# Altium schematic sheet USB-ESP32.SchDoc
size B
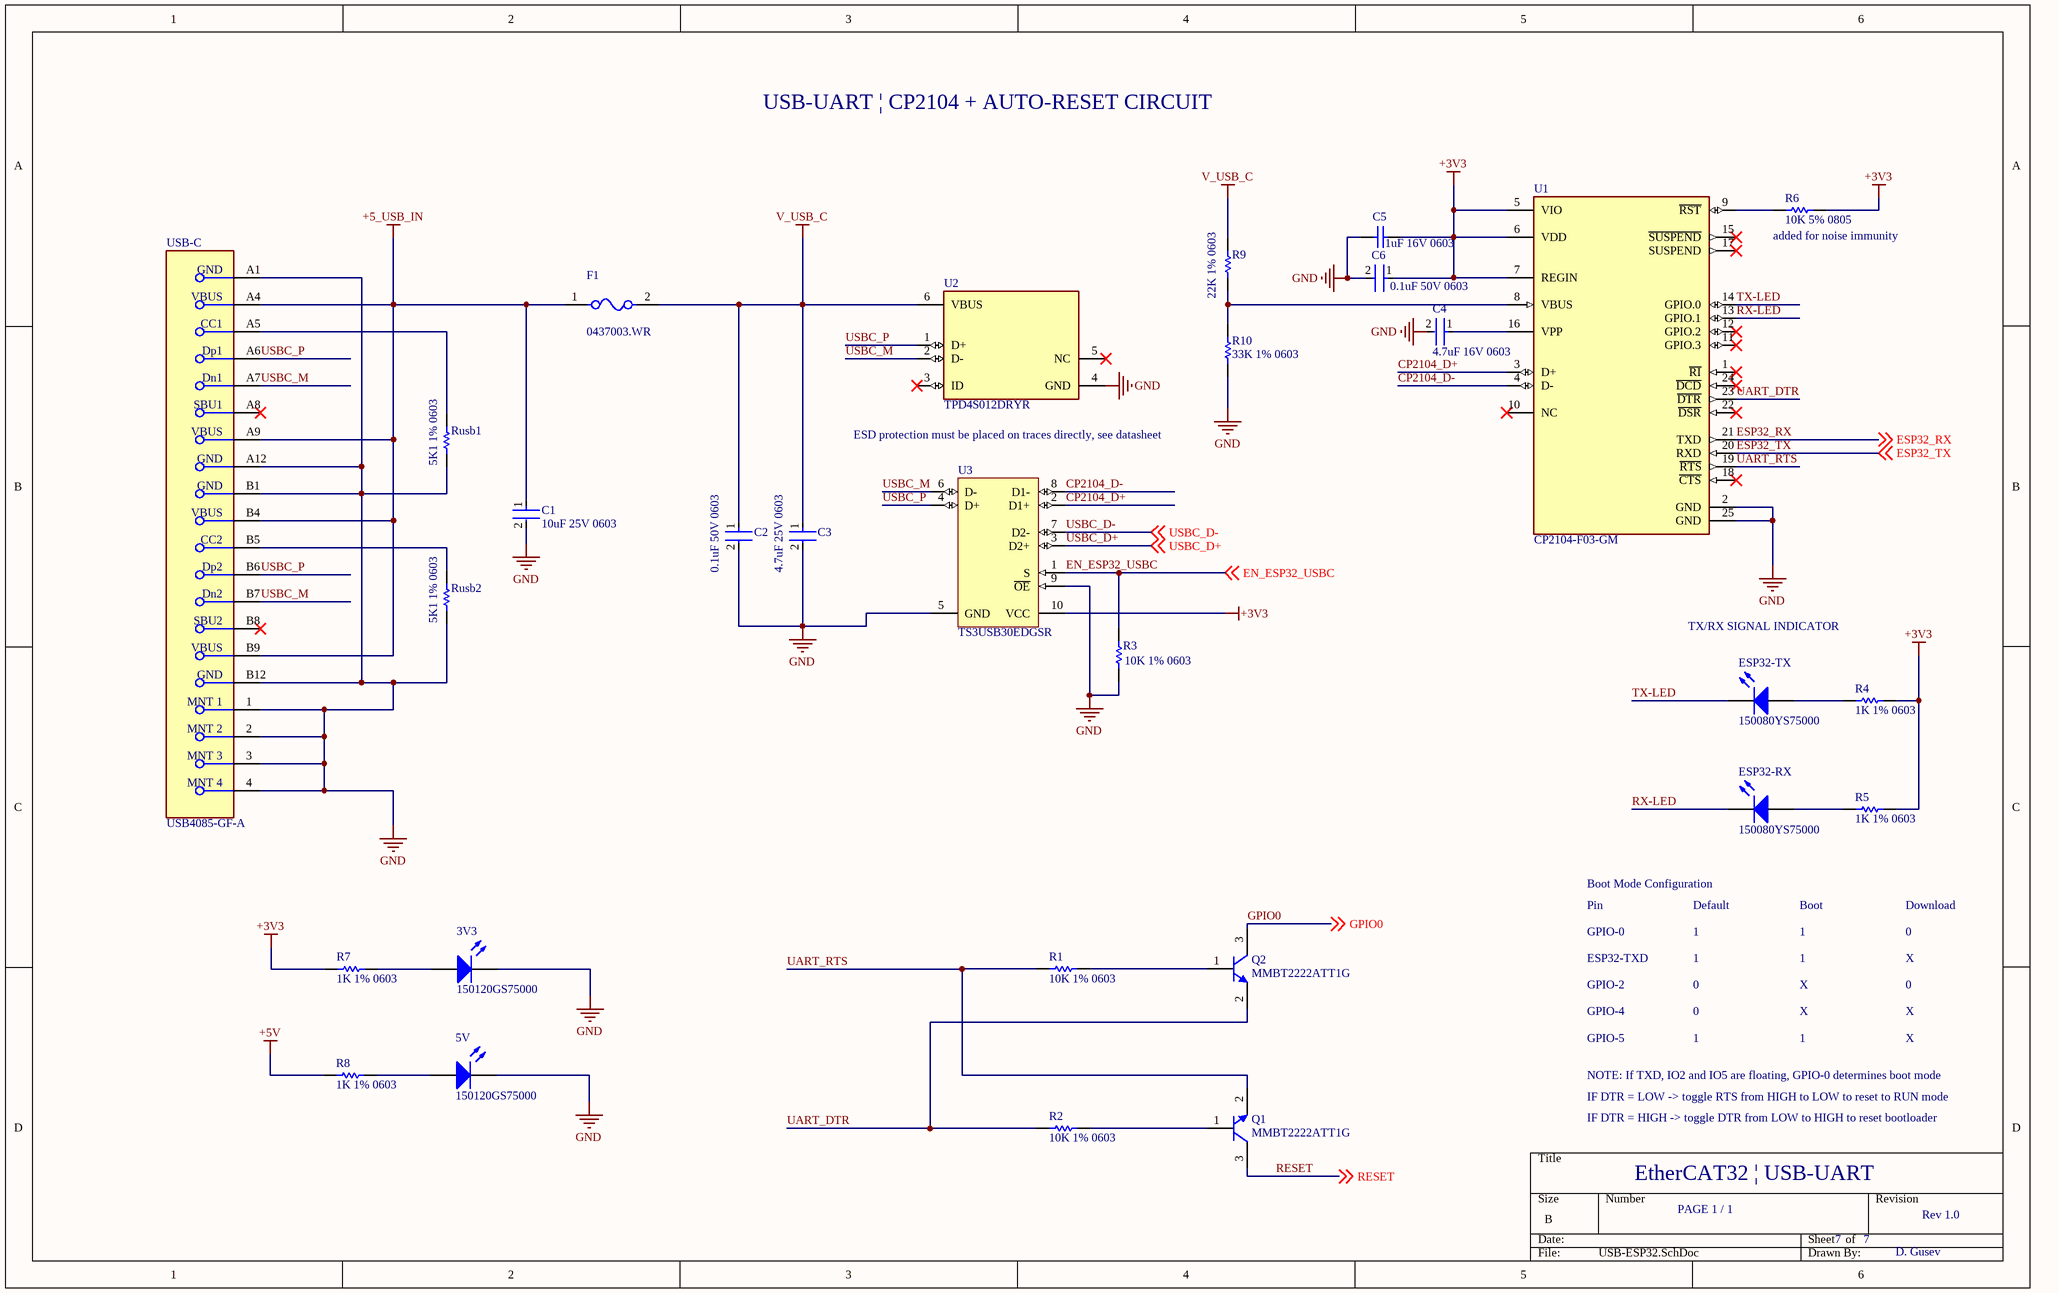
[diagram p0: USB-ESP32.SchDoc]

## Parts
3V3  150120GS75000  [1206_A]
5V  150120GS75000  [1206_A]
C1  10uF 25V 0603  [FP-C1608-080-IPC_A]
C2  0.1uF 50V 0603  [FP-C0603C-CF-MFG]
C3  4.7uF 25V 0603  [FP-C1608X5R1E475M080AC-MFG]
C4  4.7uF 16V 0603  [FP-GRM188-0_15-IPC_B]
C5  1uF 16V 0603  [CAPC1608X90X35LL15T15]
C6  0.1uF 50V 0603  [FP-C0603C-CF-MFG]
ESP32-RX  150080YS75000  [0805_A]
ESP32-TX  150080YS75000  [0805_A]
F1  0437003.WR  [FP-437-MFG]
Q1  MMBT2222ATT1G  [ONSC-SC-75-3-463-01_V]
Q2  MMBT2222ATT1G  [ONSC-SC-75-3-463-01_V]
R1  10K 1% 0603  [RESC2013X70X40ML20T20]
R2  10K 1% 0603  [RESC2013X70X40ML20T20]
R3  10K 1% 0603  [RESC2013X70X40ML20T20]
R4  1K 1% 0603  [RESC1608X55X25ML10T15]
R5  1K 1% 0603  [RESC1608X55X25ML10T15]
R6  10K 5% 0805  [RESC2013X60X40ML20T25]
R7  1K 1% 0603  [RESC1608X55X25ML10T15]
R8  1K 1% 0603  [RESC1608X55X25ML10T15]
R9  22K 1% 0603  [RESC1608X55X30NL15T15]
R10  33K 1% 0603  [RESC1608X55X25LL10T15]
Rusb1  5K1 1% 0603  [RESC1608X55X25ML10T15]
Rusb2  5K1 1% 0603  [RESC1608X55X25ML10T15]
U1  CP2104-F03-GM  [FP-CP2104-F03-GM-MFG]
U2  TPD4S012DRYR  [FP-DRY0006A-MFG]
U3  TS3USB30EDGSR  [DGS0010A_N]
USB-C  USB4085-GF-A  [FP-USB4085-GF-A-MFG]

## Nets
+3V3: C5.2 C6.1 R4.2 R5.2 R6.1 R7.1 U1.5(VIO) U1.6(VDD) U1.7(REGIN) U3.10(VCC)
+5_USB_IN: C1.1 F1.1 USB-C.A4(VBUS) USB-C.A9(VBUS) USB-C.B4(VBUS) USB-C.B9(VBUS)
+5V: R8.1
GND: 3V3.1(K) 5V.1(K) C1.2 C2.2 C3.2 C4.2 C5.1 C6.2 R3.1 R10.1 Rusb1.1 Rusb2.1 U1.2(GND) U1.25(GND) U2.4(GND) U3.5(GND) U3.9(~{OE}) USB-C.1(MNT_1) USB-C.2(MNT_2) USB-C.3(MNT_3) USB-C.4(MNT_4) USB-C.A1(GND) USB-C.A12(GND) USB-C.B1(GND) USB-C.B12(GND)
V_USB_C: C2.1 C3.1 F1.2 R9.2 U2.6(VBUS)
CP2104_D+: U1.3(D+) U3.2(D1+)
CP2104_D-: U1.4(D-) U3.8(D1-)
EN_ESP32_USBC: R3.2 U3.1(S) ; off-sheet EN_ESP32_USBC
ESP32_RX: U1.21(TXD) ; off-sheet ESP32_RX
ESP32_TX: U1.20(RXD) ; off-sheet ESP32_TX
GPIO0: Q2.3(C) ; off-sheet GPIO0
RESET: Q1.3(C) ; off-sheet RESET
RX-LED: ESP32-RX.1(K) U1.13(GPIO.1)
TX-LED: ESP32-TX.1(K) U1.14(GPIO.0)
UART_DTR: Q2.2(E) R2.2 U1.23(~{DTR})
UART_RTS: Q1.2(E) R1.2 U1.19(~{RTS})
USBC_D+: U3.3(D2+) ; off-sheet USBC_D+
USBC_D-: U3.7(D2-) ; off-sheet USBC_D-
USBC_M: U2.2(D-) U3.6(D-) USB-C.A7(Dn1) USB-C.B7(Dn2)
USBC_P: U2.1(D+) U3.4(D+) USB-C.A6(Dp1) USB-C.B6(Dp2)
Net3V3_2: 3V3.2(A) R7.2
Net5V_2: 5V.2(A) R8.2
NetC4_1: C4.1 U1.16(VPP)
NetESP32-RX_2: ESP32-RX.2(A) R5.1
NetESP32-TX_2: ESP32-TX.2(A) R4.1
NetQ1_1: Q1.1(B) R2.1
NetQ2_1: Q2.1(B) R1.1
NetR6_2: R6.2 U1.9(~{RST})
NetR9_1: R9.1 R10.2 U1.8(VBUS)
NetRusb1_2: Rusb1.2 USB-C.A5(CC1)
NetRusb2_2: Rusb2.2 USB-C.B5(CC2)

Not connected (* = marked no-connect by the designer): U1 1(~{RI})* 10(NC)* 11(GPIO.3)* 12(GPIO.2)* 15(~{SUSPEND})* 17(SUSPEND)* 18(~{CTS})* 22(~{DSR})* 24(~{DCD})*; U2 3(ID)* 5(NC)*; USB-C A8(SBU1)* B8(SBU2)*

## Notes on the sheet
- USB-UART | CP2104 + AUTO-RESET CIRCUIT
- (near R6) added for noise immunity
- ESD protection must be placed on traces directly, see datasheet
- TX/RX SIGNAL INDICATOR
- Boot Mode Configuration
- Pin
- Default
- Boot
- Download
- GPIO-0
- ESP32-TXD
- 1
- 0
- X
- GPIO-2
- GPIO-4
- GPIO-5
- NOTE: If TXD, IO2 and IO5 are floating, GPIO-0 determines boot mode
- IF DTR = LOW -> toggle RTS from HIGH to LOW to reset to RUN mode
- IF DTR = HIGH -> toggle DTR from LOW to HIGH to reset bootloader
- EtherCAT32 | USB-UART
- PAGE 1 / 1
- 7
- Rev 1.0
- D. Gusev

## Library data of the parts
3V3 5V = CMP-1426-00014-1: SMD mono-color Chip LED, WL-SMCW, Green; Manufacturer: Wuerth Elektronik; PackageReference: 1206_A; PartNumber: 150120GS75000; ComponentLink1Description: Manufacturer URL; ComponentLink2URL: http://katalog.we-online.com/led/datasheet/150120GS75000.pdf; ComponentLink2Description: Datasheet; Color: Green; ComponentLink1URL: http://www.we-online.com
C1 = CMP-2000-05442-2: CAP CER 10UF 25V X5R 0603; Dielectric Material: Ceramic; Tolerance: 20%; Dielectric: X5R; Length: 1.6mm; Termination: SMD/SMT; Depth: 0.8mm; RoHS Compliant: Yes; Construction: Flat; Weight: 7.1E-05oz; Thickness: 0.039inch; Packaging: Tape and Reel; Min Operating Temperature: -55°C; Case Code (Imperial): 0603; Case/Package: 0603; Height: 0.8mm; Case Code (Metric): 1608; Voltage Rating: 25V; Resistor Type: Ceramic; Voltage Rating (DC): 25V; Max Operating Temperature: 85°C; REACH SVHC: No SVHC; Lead Free: Lead Free; Series: C; Width: 0.8mm; Mount: Surface Mount; Package Quantity: 1; Capacitance: 10uF
C2 C6 = CMP-2006-03061-2: CAP CER 0.1UF 50V X7R 0603; Manufacturer: KEMET; Manufacturer Part Number: C0603C104K5RACTU; Tolerance: 0.1; Description: C0603 0.10 μF X7R 30ppm/°C 10.00% 50 V; Temperature Coefficient: 30ppm/°C; Material: Ceramic; Automotive Grade: Grade 1; Value: 0.10 μF; Temperature: -55°C to +125°C; RoHS: TRUE; Temperature Range High: +125°C; Lead Free: Yes; Octopart: https://octopart.com/c0603c104k5ractu-kemet-139244; Digikey Description: CAP CER 0.1UF 50V X7R 0603; Category: Cap; Package: C0603C-CF; ComponentLink2Description: Datasheet; Temperature Range Low: -55°C; Device Class L1: Passive Components; Voltage Rating: 50 V; Automotive: Yes; Device Class L3: Ceramic Capacitors; ComponentLink2URL: https://api.kemet.com/component-edge/download/datasheet/C0603C100J5GACAUTO.pdf; Capacitance: 0.10 μF; Device Class L2: Capacitors; Temperature Characteristic: X7R; Height: 0.87mm
C3 = CMP-08246-004335-1: Multilayer Ceramic Capacitors 4.7μF ±20% 25V X5R SMD 0603; Capacitance: 4.7uF; Voltage Rating (DC): 25V; Width: 0.031inch; Resistor Type: Ceramic; Radiation Hardening: No; Lead Free: Lead Free; Min Operating Temperature: -55°C; Case Code (Metric): 1608; Case/Package: 0603; Case Code (Imperial): 0603; Dielectric Material: Ceramic; Series: C; Thickness: 0.039inch; Tolerance: 20%; Termination: SMD/SMT; Length: 1.6mm; Depth: 0.8mm; Mount: Surface Mount; Voltage Rating: 25V; Weight: 7.1E-05oz; RoHS Compliant: Yes; Height: 0.8mm; Dielectric: X5R; REACH SVHC: No SVHC; Packaging: Tape and Reel; Max Operating Temperature: 85°C; Package Quantity: 1
C4 = CMP-06035-062935-1: CAP CER 4.7UF 16V X5R 0603; Tolerance: 10%; Material: Ceramic; Thickness: 0.037inch; RoHS Compliant: Yes; REACH SVHC: No SVHC; Case Code (Metric): 1608; Width: 0.8mm; Lead Free: Lead Free; Packaging: Tape and Reel; Capacitance: 4.7uF; Depth: 0.8mm; Package Quantity: 4000; Mount: Surface Mount; Voltage Rating: 16V; Termination: SMD/SMT; Height: 0.8mm; Voltage Rating (DC): 16V; Weight: 0.000222oz; Dielectric: X5R; Case Code (Imperial): 0603; Series: GRM; Min Operating Temperature: -55°C; Max Operating Temperature: 85°C; Case/Package: 0603; Length: 1.6mm
C5 = CMP-2006-02298-2: Manufacturer: Kemet; Part Number: C0603C105K4RACTU
ESP32-RX ESP32-TX = CMP-1426-00012-1: SMD mono-color Chip LED, WL-SMCW, Yellow; Manufacturer: Wuerth Elektronik; Color: Yellow; ComponentLink1URL: http://www.we-online.com; PackageReference: 0805_A; ComponentLink2URL: http://katalog.we-online.com/led/datasheet/150080YS75000.pdf; ComponentLink1Description: Manufacturer URL; ComponentLink2Description: Datasheet; PartNumber: 150080YS75000
F1 = CMP-08605-000049-1: FUSE BRD MNT 3A 32VAC 35VDC 1206; Manufacturer: Littelfuse Inc; Fuse Interrupt Ac Current: 50A; Value: 0.033Ω; Fuse Blow Speed: Fast; Voltage Rating: 32V; Max Fuse Dc Voltage: 35V; Fuse I2T: 0.506A2Sec; Fuse Voltage Drop: 0.14V; Octopart: https://octopart.com/0437003.wr-littelfuse-8600121; Category: Fuse; Fuse Interrupt Dc Current: 50A; Temperature: -55°C to +150°C; Device Class L1: Circuit Protection; Fuse Current: 3A; Temperature Range High: +150°C; Temperature Range Low: -55°C; Resistance: 0.033Ω; Automotive: No; ComponentLink2URL: https://www.littelfuse.com/~/media/electronics/datasheets/fuses/littelfuse_fuse_437_datasheet.pdf.pdf; Manufacturer Part Number: 0437003.WR; Ipc Land Pattern Name: CAPC320163X82; Mouser Description: Surface Mount Fuses 32V FA 1206 3A; Device Class L2: Fuses; Device Class L3: unset; Package: 437; RoHS: TRUE; Height: 0.8639mm; Digikey Description: FUSE BRD MNT 3A 32VAC 35VDC 1206; ComponentLink2Description: Datasheet; Lead Free: Yes; Max Fuse Ac Voltage: 32V
Q1 Q2 = CMP-1048-00417-1: General Purpose Transistor, NPN Silicon, 3-Pin SC-75, Pb-Free, Tape and Reel; Manufacturer: On Semiconductor; IC Continuous (A): 0.6; fT Min (MHz): 300; DatasheetVersion: Rev. 5; PackageVersion: Rev. F, 07/2005; ComponentLink1Description: Manufacturer URL; RoHS: TRUE; Packing: Tape and Reel; ComponentLink3URL: http://www.onsemi.com/pub_link/Collateral/463-01.PDF; ComponentLink1URL: http://www.onsemi.com/; ComponentLink3Description: Package Specification; ComponentLink2URL: http://www.onsemi.cn/pub_link/Collateral/MMBT2222ATT1-D.PDF; Mounting Technology: Surface Mount; PartNumber: MMBT2222ATT1G; ComponentLink2Description: Datasheet; Polarity: NPN; PackageReference: SC-75-3-463-01; PackageDescription: 3-Pin Small Outline Transistor, Body 1.6 x 0.8 mm, Pitch 0.5 mm
R1-R3 = CMP-2001-04376-1: Manufacturer: Panasonic; Part Number: ERJ-6ENF1002V
R4 R5 R7 R8 = CMP-2000-05023-1: Chip Resistor, 1 KOhm, +/- 5%, 0.063 W, -55 to 155 degC, 0603 (1608 Metric), RoHS, Tape and Reel; Manufacturer: Yageo; Resistor Case Style: 0603[1608Metric]; Resistor Element Type: ThickFilm; Product Range: RCSeries; Resistance: 1kohm; SVHC: ToBeAdvised; Voltage Rating: 50V; Temperature Coefficient: ±100ppm/degC; Power Rating: 100mW; Packaging: CutTape; Manufacturer URL: http://www.yageo.com/; Resistance Tolerance: ±5%; Datasheet Version: Rev. 4, 04/2009; MSL: MSL1-Unlimited; Package Description: 2-Pin Surface Mount Device, Body 1.6 x 0.8 mm; Automotive Qualification Standard: -; Package Reference: 603; Datasheet URL: https://datasheet.ciiva.com/2452/pyu-rc0603-51-rohs-l-4-2452848.pdf
R6 = CMP-2001-00590-1: Part Number: ERA6AEB123V; Manufacturer: Panasonic
R9 = CMP-2000-00337-2: Chip Resistor, 22 KOhm, +/- 1%, 0.1 W, -55 to 155 degC, 0603 (1608 Metric), RoHS, Tape and Reel; Resistance: 33.2 kohm; Case\Package: 0603; Power Rating: 100 mW; Voltage Rating: 50 V; ComponentLink2Description: Datasheet; PackageDescription: 2-Pin Surface Mount Device, Body 1.6 x 0.85 mm; Length: 1.6 mm; Package Quantity: 200; ComponentLink1Description: Manufacturer URL; Width: 0.8 mm; Tolerance: 1%; ComponentLink2URL: http://industrial.panasonic.com/cdbs/www-data/pdf/RDA0000/AOA0000C86.pdf; Case Code (Metric): 1608; Case Code (Imperial): 0603; PackageReference: 0603; DatasheetVersion: Apr-15; Packaging: Tape and Reel; Max Operating Temperature: 155 degC; Height: 0.45 mm; ComponentLink1URL: http://www.panasonic.com/; Min Operating Temperature: -55 degC; RoHSCompliant: true
R10 = CMP-2000-06938-1: Chip Resistor, 33 KOhm, +/- 1%, 0.1 W, -55 to 155 degC, 0603 (1608 Metric), RoHS, Tape and Reel; Manufacturer: Yageo; Voltage Rating: 50V; Power Rating: 100mW; Resistance: 33kOhms; Temperature Coefficient: 100PPM/C; Datasheet Version: Rev. 7, 05/2017; Case Code - in: 0603; Product: ThickFilmResistorsGeneralPurpose; Tolerance: 1%; Case Code - mm: 1608; Manufacturer URL: http://www.yageo.com/; Datasheet URL: http://www.yageo.com/documents/recent/PYu-RC_Group_51_RoHS_L_7.pdf; Termination Style: SMD/SMT; Package Description: 2-Pin Surface Mount Device, Body 1.6 x 0.8 mm; Series: RC; Packaging: Reel; Mounting Technology: SurfaceMount; Operating Temperature Range: -55Cto+155C; Package Reference: 0603
Rusb1 Rusb2 = CMP-2000-04091-1: Manufacturer: Yageo; Part Number: RC0603FR-075K1L
U1 = CMP-0511-00004-2: IC SGL USB-TO-UART BRIDGE 24QFN; Number of Transceivers: 1; Max Supply Voltage: 3.6V; Operating Supply Current: 17mA; Operating Supply Voltage: 3.3V; Data Rate: 2Mbps; Min Supply Voltage: 3V; Number of Channels: 1; Max Operating Temperature: 85°C; Contact Plating: Tin; Min Operating Temperature: -40°C; Number of Pins: 24; Case/Package: QFN; Packaging: Rail/Tube; Radiation Hardening: No; Weight: 0.001764oz
U2 = CMP-0326-00038-4: TVS DIODE 5.5V 6SON; Breakdown Voltage: 24V; Interface: USB; ESD Protection: Yes; Peak Pulse Power: 60W; Number of Circuits: 4; Polarity: Unidirectional; Capacitance: 15pF; Test Current: 1mA; Working Voltage: 19V; Min Breakdown Voltage: 6V; Peak Pulse Current: 3A; Operating Supply Voltage: 950mV; Max Operating Temperature: 85°C; Packaging: Tape and Reel; Termination: SMD/SMT; Number of Pins: 6; Radiation Hardening: No; Width: 1.05mm; REACH SVHC: No SVHC; Lead Free: Lead Free; Depth: 1mm; Package Quantity: 5000; Length: 1.45mm; Direction: Unidirectional; Min Operating Temperature: -40°C; Number of Channels: 4; Max Power Dissipation: 60W; Height: 0.55mm
U3 = CMP-0309-00091-2: High-Speed USB 2.0 (480-Mbps) 1:2 Multiplexer / Demultiplexer Switch with Single, 10 ohm RON, 3.0 to 4.3V, -40 to 85 degC, 10-Pin MSOP (DGS), Green (RoHS & no Sb/Br); Manufacturer: Texas Instruments; Architecture: "1","2 mux/demux"; tpd max(ns): 0.25; ICC(uA): 1; IL OFF(Max)(nA): 2; OFF Time(Max)(ns): 30; SubFamily: USB Switch; ESD HBM(kV): +/-8; Bandwidth(MHz): 900; RON Mis-match(Max)(Ohms): 0.35; ON Time(Max)(ns): 25; ron(max)(ohms): 10; PartNumber: TS3USB30EDGSR; ComponentLink1URL: http://www.ti.com/general/docs/lit/getliterature.tsp?genericPartNumber=TS3USB30E&fileType=pdf; Vcc range(V): 3.0 to 4.3; PackageReference: DGS0010A; Code_JEDEC: MO-187-BA; PackageDescription: 10-Pin Thin Shrink Small Outline Package 0.5 mm Pitch; Eco-Plan: Green (RoHS & no Sb/Br); ComponentLink2URL: http://www.ti.com/litv/pdf/mpds035b; Number of Channels: 2; Mounting Technology: Surface Mount; PackageVersion: revC, Feb-2004; DatasheetVersion: SCDS255D; ComponentLink1Description: Datasheet; ComponentLink2Description: Package Specification; RON Flatness(Max)(Ohms): 2
USB-C = CMP-196119-000001-1: CONN RCPT USB2.0 TYPEC 16POS; Manufacturer: Global Connector Technology; Voltage Rating: 20V; Conn Orientation: Right Angle; Shielding: true; Current Rating: 4.25A; Number Of Contacts: 16; Pitch: 0.85mm; Is Female: yes; ComponentLink2URL: https://gct.co/files/drawings/usb4085.pdf; Category: Conn; Automotive: No; ComponentLink2Description: Datasheet; Height: 3.66mm; Manufacturer Part Number: USB4085-GF-A; Package: 0; Usb Standard: USB 2.0; Octopart: https://octopart.com/usb4085-gf-a-global+connector+technology-94773699; Device Class L3: unset; Digikey Description: CONN RCPT USB2.0 TYPEC 16POS; Temperature Range Low: -40°C; Temperature: -40°C to +85°C; Lead Free: Yes; Contact Material: Gold,Nickel; Device Class L1: Connectors; Temperature Range High: +85°C; Device Class L2: USB Connectors; RoHS: TRUE